# Altium schematic sheet nguon.SchDoc
size A; SheetNumber: 1; SheetTotal: 1
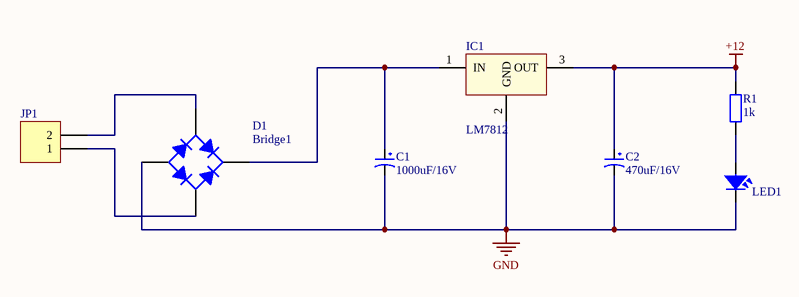
[diagram p0: nguon.SchDoc]

## Parts
C1  1000uF/16V  [CP1.5/3.4]
C2  470uF/16V  [CP1.5/3.4]
D1  Bridge1  [D-38]
IC1  LM7812  [QTO-220]
JP1  Header 2  [CON2]  (value not drawn)
LED1  LED  [LED-3]  (value not drawn)
R1  1k  [R1/4W]

## Nets
+12: C2.1 IC1.3(OUT) R1.2
GND: C1.2 C2.2 D1.3(A) IC1.2(GND) LED1.2
NetC1_1: C1.1 D1.1(K) IC1.1(IN)
NetD1_2: D1.2(C) JP1.1
NetD1_4: D1.4(C) JP1.2
NetLED1_1: LED1.1 R1.1

## Library data of the parts
C1 C2 = CP4: Cap 1000uF/16V - 220uF/50V; Description 5: 4,7uF>10uF/250V_3,3uF>10uF/400V - 2,2uF>4,7uF/450V; Description 1: 2200uF-3300uF/6,3V - 1000uF-2200uF/10V; Description 2: 1000uF/16V - 470uF => 1000uF/25V - 100uF/100V; Description 3: 330uF>470uF/35V_220uF>470uF/50V_10uF>22uF/250V; Description 4: 220uF => 330uF/63V - 10uF =>33uF/160 - 200V; Value: 1000uF/16V
D1 = Bridge1: Full Wave Diode Bridge; Published: 8-Jun-2000; LatestRevisionDate: 29-May-2009; LatestRevisionNote: Sch pins A & K swapped.; DatasheetVersion: E2732B; PackageReference: D-38; Publisher: Altium Limited; PackageDescription: Bridge Rectifier; 4 Terminals; Body 9.4 x 9.4 mm (typ); Pitch 5.08 mm
IC1 = LM78xx: On ap +, from + 5 to + 24VDC; Value: LM7805
JP1 = Header 2: Header, 2-Pin; Manufacturer: Generic Components; Class: Connector; Value: Header 2
LED1 = LED: LED Single colour Green and Red; Value: LED 3 ly Single Colour
R1 = R1/4W: Resistor 1/4W; Value: R1/4W - 1K